# Altium schematic sheet 24V_to_5V.SchDoc
size A4
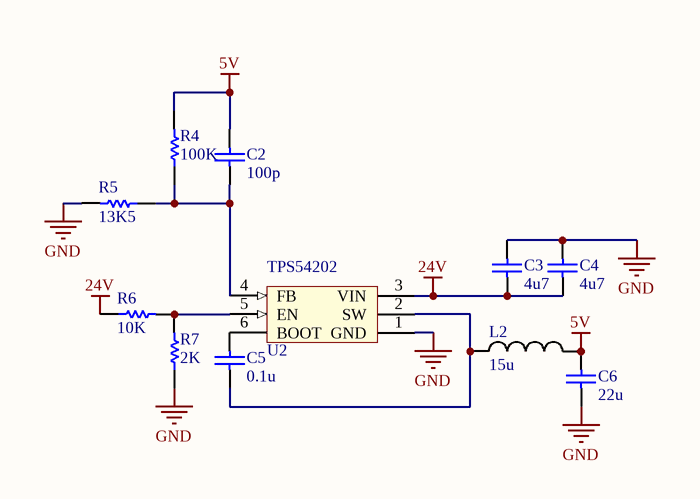
[diagram p0: 24V_to_5V.SchDoc]

## Parts
C2  value 100p  [CAPC1608X90N]  (hidden comment: Cap)
C3  value 4u7  [CAPC2012X135N]  (hidden comment: Cap)
C4  value 4u7  [CAPC2012X135N]  (hidden comment: Cap)
C5  value 0.1u  [CAPC1608X90N]  (hidden comment: Cap)
C6  value 22u  [CAPC2012X135N]  (hidden comment: Cap)
L2  value 15u  [INDC_5.5x5.3x3]  (hidden comment: 15uH inductor)
R4  value 100K  [RESC1608X55N]  (hidden comment: Res1)
R5  value 13K5  [RESC1608X55N]  (hidden comment: Res1)
R6  value 10K  [RESC1608X55N]  (hidden comment: Res1)
R7  value 2K  [RESC1608X55N]  (hidden comment: Res1)
U2  TPS54202  [SOT23-6]

## Nets
5V: C2.2 C6.2 L2.2 R4.2
24V: C3.2 C4.2 R6.1 U2.3(VIN)
GND: C3.1 C4.1 C6.1 R5.2 R7.1 U2.1(GND)
NetC2_1: C2.1 R4.1 R5.1 U2.4(FB)
NetC5_1: C5.1 L2.1 U2.2(SW)
NetC5_2: C5.2 U2.6(BOOT)
NetR6_2: R6.2 R7.2 U2.5(EN)

## Library data of the parts
C2-C6 = Cap: Capacitor; Published: 8-Jun-2000; LatestRevisionDate: 17-Jul-2002; LatestRevisionNote: Re-released for DXP Platform.; PackageReference: RAD-0.3; Publisher: Altium Limited; PackageDescription: Radial Cap, Thru-Hole; 2 Leads; 0.3 in Pin Spacing
L2 = INDC_MPX1D0530L150: 15uH inductor with 2A saturation current. Dimension is 5.5 * 5.2 * 3 mm^3; Saturation Current: 2A
R4-R7 = Res1: Resistor; Published: 8-Jun-2000; LatestRevisionDate: 17-Jul-2002; LatestRevisionNote: Re-released for DXP Platform.; PackageReference: AXIAL-0.3; Publisher: Altium Limited; PackageDescription: Axial Device, Thru-Hole; 2 Leads; 0.3 in Pin Spacing
U2 = TPS54202: 4.5-28V input 2A output step down, EMI Friendly Synchronous Step Down Converter; Vin(max): 28V; Vin(min): 4.5V; Currrent: 2A